# EAGLE design bh (EAGLE 9.6.1)
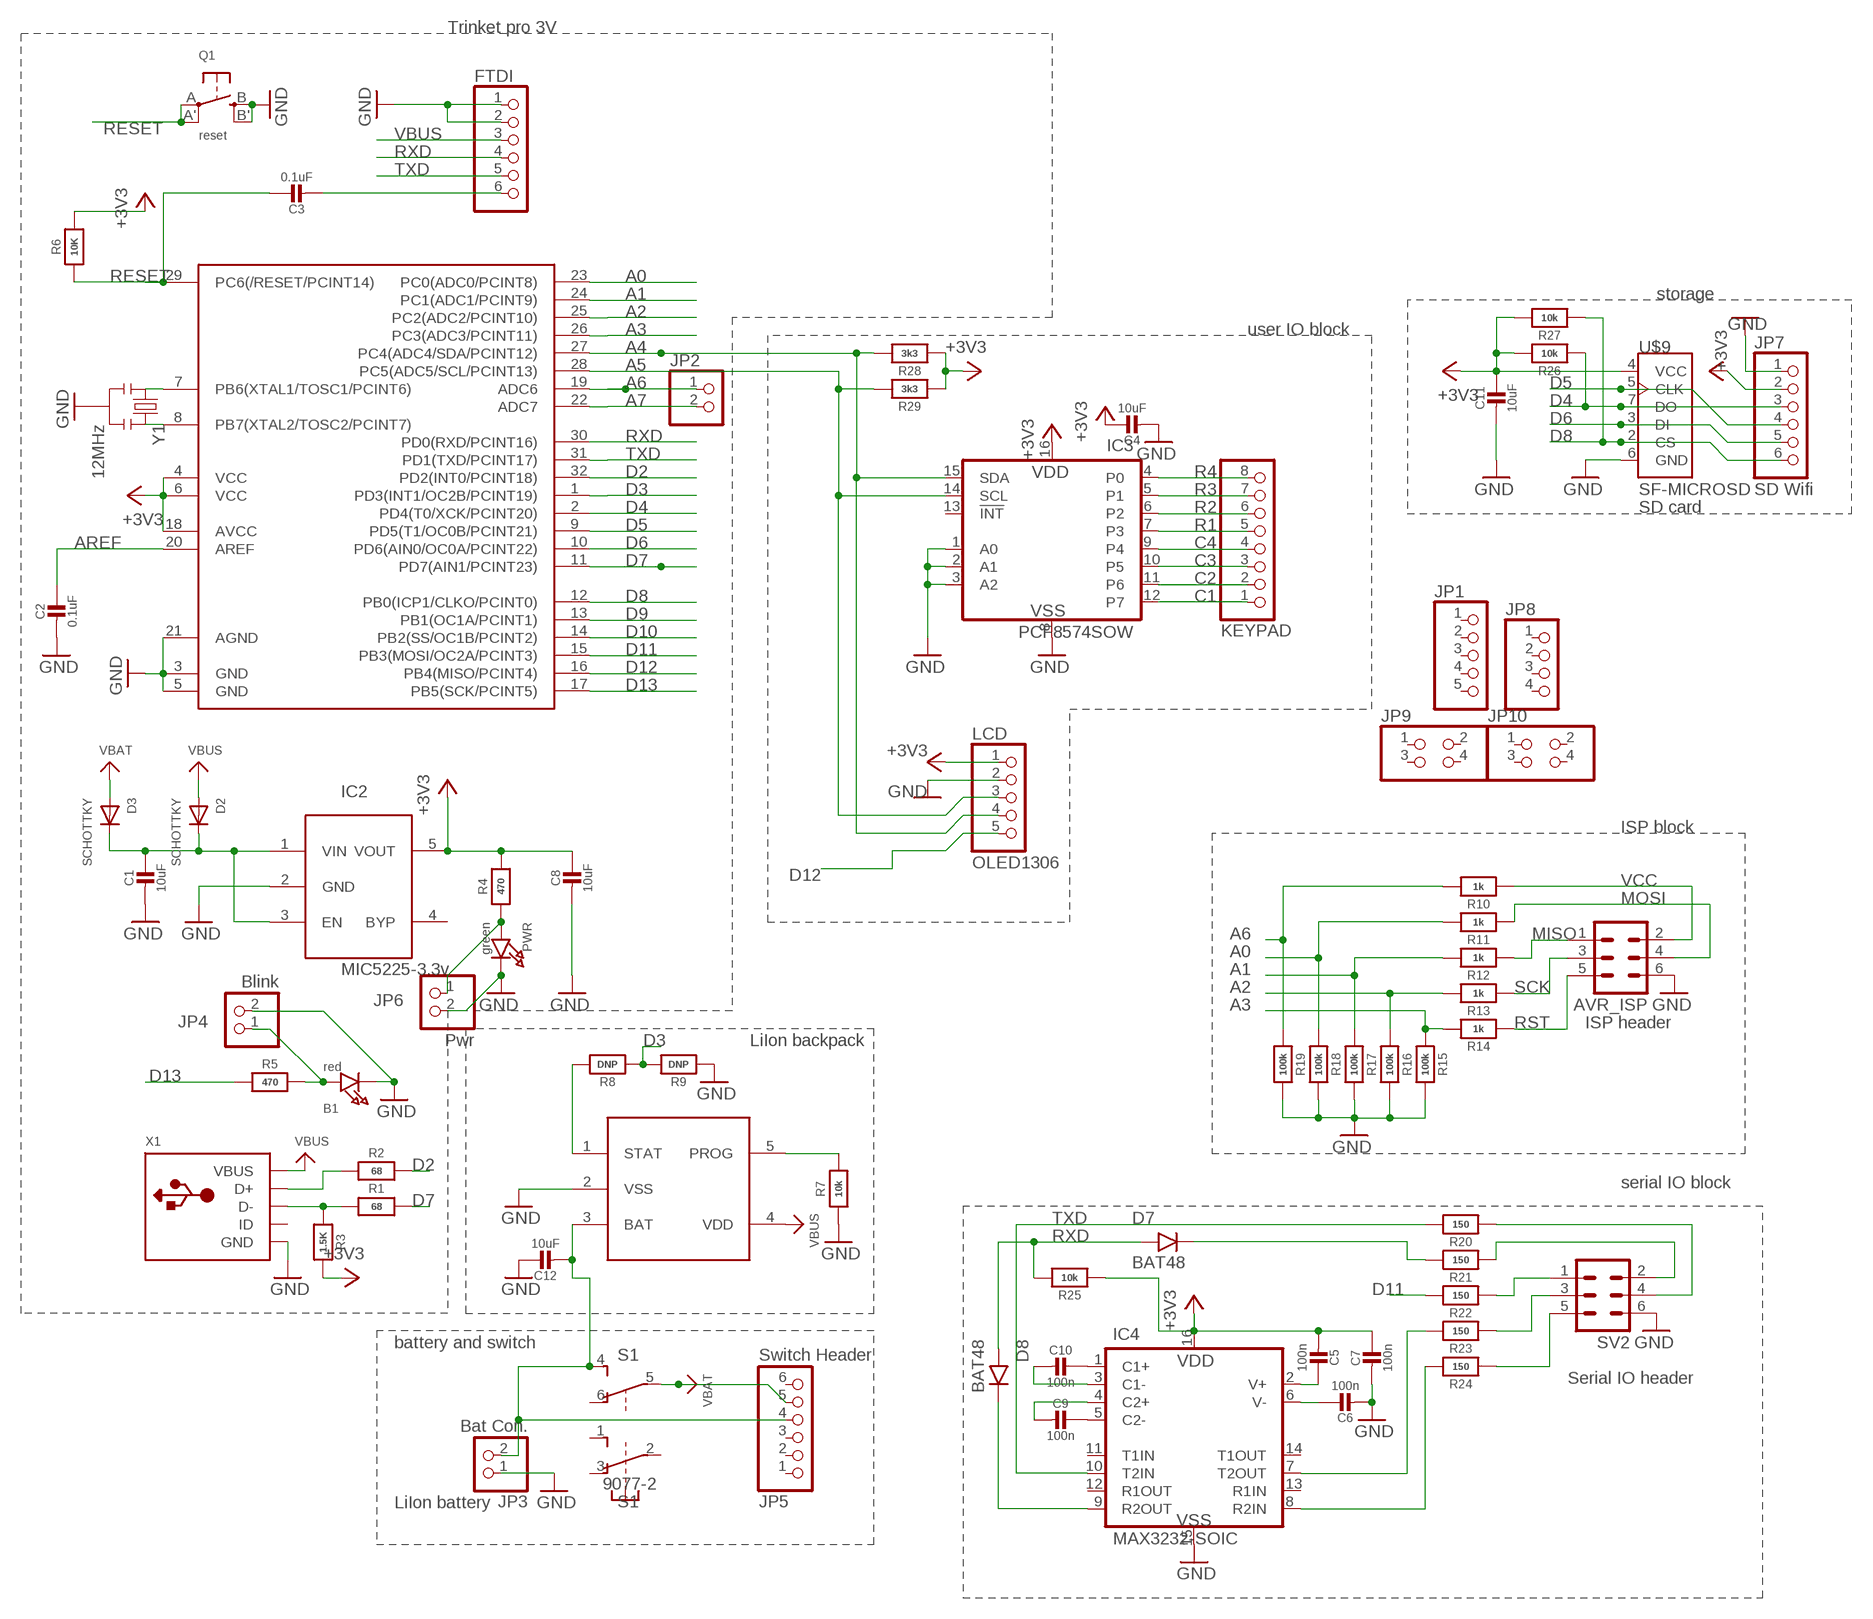
[diagram p0: schematic, sheet 1]

## Parts
AVR_ISP  ML6  [ML6]
B1  red  LED0805_NOOUTLINE  [CHIPLED_0805_NOOUTLINE]
C1  10uF  CAP_CERAMIC0805-NOOUTLINE  [0805-NO]
C2  0.1uF  CAP_CERAMIC_0805MP  [_0805MP]
C3  0.1uF  CAP_CERAMIC0805-NOOUTLINE  [0805-NO]
C4  10uF  CAP_CERAMIC0805-NOOUTLINE  [0805-NO]
C5  100n  CAP_CERAMIC0805-NOOUTLINE  [0805-NO]
C6  100n  CAP_CERAMIC0805-NOOUTLINE  [0805-NO]
C7  100n  CAP_CERAMIC0805-NOOUTLINE  [0805-NO]
C8  10uF  CAP_CERAMIC0805-NOOUTLINE  [0805-NO]
C9  100n  CAP_CERAMIC0805-NOOUTLINE  [0805-NO]
C10  100n  CAP_CERAMIC0805-NOOUTLINE  [0805-NO]
C11  10uF  CAP_CERAMIC0805-NOOUTLINE  [0805-NO]
C12  10uF  CAP_CERAMIC0805-NOOUTLINE  [0805-NO]
D2  SCHOTTKY  ADAFRUIT_DIODE_SOD-123FL  [ADAFRUIT_SOD-123FL]
D3  SCHOTTKY  ADAFRUIT_DIODE_SOD-123FL  [ADAFRUIT_SOD-123FL]
D7  BAT48  1N4148SOD  [SOD-80]
D8  BAT48  1N4148SOD  [SOD-80]
FTDI  ADAFRUIT_PINHD-1X6CB  [ADAFRUIT_1X06-CLEANBIG]
IC2  MIC5225-3.3v  LP298XS  [SOT23-5L]
IC3  PCF8574SOW  [SO-16DW]
IC4  MAX3232-SOIC  [SO-16]
IC5  MEGA328P  MEGA48/88/168-AU  [TQFP32-08]
JP1  PINHD-1X5  [1X05]
JP2  HEADER-1X2ROUND  [1X02_ROUND]
JP3  Bat Con.  PINHD-1X02_2.54-90°  [1X02/90]
JP4  Blink  PINHD-1X2  [1X02]
JP5  Switch Header  PINHD-1X6  [1X06]
JP6  Pwr  PINHD-1X2  [1X02]
JP7  SD Wifi  PINHD-1X6  [1X06]
JP8  PINHD-1X4  [1X04]
JP9  PINHD-2X2  [2X02]
JP10  PINHD-2X2  [2X02]
KEYPAD  PINHD-1X8  [1X08]
LCD  OLED1306  PINHD-1X5  [1X05]
PWR  green  LED0805_NOOUTLINE  [CHIPLED_0805_NOOUTLINE]
Q1  reset  SWITCH_TACT_SMT4.6X2.8  [BTN_KMR2_4.6X2.8]
R1  68  RESISTOR_0603_NOOUT  [0603-NO]
R2  68  RESISTOR_0603_NOOUT  [0603-NO]
R3  1.5K  RESISTOR_0603_NOOUT  [0603-NO]
R4  470  RESISTOR_0603_NOOUT  [0603-NO]
R5  470  RESISTOR_0603_NOOUT  [0603-NO]
R6  10K  RESISTOR0805_NOOUTLINE  [0805-NO]
R7  10k  RESISTOR_0805  [_0805]
R8  DNP  RESISTOR_0805  [_0805]
R9  DNP  RESISTOR_0805  [_0805]
R10  1k  RESISTOR_0805  [_0805]
R11  1k  RESISTOR_0805  [_0805]
R12  1k  RESISTOR_0805  [_0805]
R13  1k  RESISTOR_0805  [_0805]
R14  1k  RESISTOR_0805  [_0805]
R15  100k  RESISTOR_0805  [_0805]
R16  100k  RESISTOR_0805  [_0805]
R17  100k  RESISTOR_0805  [_0805]
R18  100k  RESISTOR_0805  [_0805]
R19  100k  RESISTOR_0805  [_0805]
R20  150  RESISTOR_0805  [_0805]
R21  150  RESISTOR_0805  [_0805]
R22  150  RESISTOR_0805  [_0805]
R23  150  RESISTOR_0805  [_0805]
R24  150  RESISTOR_0805  [_0805]
R25  10k  RESISTOR_0805  [_0805]
R26  10k  RESISTOR_0805  [_0805]
R27  10k  RESISTOR_0805  [_0805]
R28  3k3  RESISTOR_0805  [_0805]
R29  3k3  RESISTOR_0805  [_0805]
S1  9077-2  [9077-2]
SV2  ML6  [ML6]
U$6  MCP73831  [SOT23-5]
U$9  SF-MICROSD  [MICROSD]
X1  MICROBUILDER_USBMICRO_20329  [MICROBUILDER_4UCONN_20329]
Y1  12MHz  RESONATORSMD  [RESONATOR-SMD]

## Nets
+3V3: C4.1 C5.2 C7.1 C8.1 C11.1 IC2.5(VOUT) IC3.16(VDD) IC4.16(VDD) IC5.4(VCC) IC5.6(VCC) IC5.18(AVCC) JP7.2 LCD.1 R3.2 R4.2 R6.2 R25.2 R26.1 R27.1 R28.2 R29.2 U$9.4(VCC)
A0: IC5.23(PC0(ADC0/PCINT8)) R11.1 R18.2
A1: IC5.24(PC1(ADC1/PCINT9)) R12.1 R17.2
A2: IC5.25(PC2(ADC2/PCINT10)) R13.1 R16.2
A3: IC5.26(PC3(ADC3/PCINT11)) R14.1 R15.2
A4: IC3.15(SDA) IC5.27(PC4(ADC4/SDA/PCINT12)) LCD.4 R28.1
A5: IC3.14(SCL) IC5.28(PC5(ADC5/SCL/PCINT13)) LCD.3 R29.1
A6: IC5.19(ADC6) JP2.1 R10.1 R19.2
A7: IC5.22(ADC7) JP2.2
AREF: C2.1 IC5.20(AREF)
C1: IC3.12(P7) KEYPAD.1
C2: IC3.11(P6) KEYPAD.2
C3: IC3.10(P5) KEYPAD.3
C4: IC3.9(P4) KEYPAD.4
D2: IC5.32(PD2(INT0/PCINT18)) R2.2
D3: IC5.1(PD3(INT1/OC2B/PCINT19)) R8.2 R9.1
D4: IC5.2(PD4(T0/XCK/PCINT20)) JP7.3 R26.2 U$9.7(DO)
D5: IC5.9(PD5(T1/OC0B/PCINT21)) JP7.4 U$9.5(CLK)
D6: IC5.10(PD6(AIN0/OC0A/PCINT22)) JP7.5 U$9.3(DI)
D7: IC5.11(PD7(AIN1/PCINT23)) R1.2
D8: IC5.12(PB0(ICP1/CLKO/PCINT0)) JP7.6 R27.2 U$9.2(CS)
D9: IC5.13(PB1(OC1A/PCINT1))
D10: IC5.14(PB2(SS/OC1B/PCINT2))
D11: IC5.15(PB3(MOSI/OC2A/PCINT3)) R22.1
D12: IC5.16(PB4(MISO/PCINT4)) LCD.5
D13: IC5.17(PB5(SCK/PCINT5)) R5.2
D+: R2.1 X1.D+
D-: R1.1 R3.1 X1.D-
DTR/RTS: C3.2 FTDI.6
GND: AVR_ISP.6 B1.C C1.2 C2.2 C4.2 C6.2 C7.2 C8.2 C11.2 C12.1 FTDI.1 FTDI.2 IC2.2(GND) IC3.1(A0) IC3.2(A1) IC3.3(A2) IC3.8(VSS) IC4.15(VSS) IC5.3(GND) IC5.5(GND) IC5.21(AGND) JP3.1 JP4.2 JP6.2 JP7.1 LCD.2 PWR.C Q1.B'(S1) Q1.B(S) R7.2 R9.2 R15.1 R16.1 R17.1 R18.1 R19.1 SV2.6 U$6.2(VSS) U$9.6(GND) X1.BASE@1(GND) X1.BASE@2(GND) X1.GND X1.SPRT@1(GND) X1.SPRT@2(GND) X1.SPRT@3(GND) X1.SPRT@4(GND) Y1.2
MISO: AVR_ISP.1 R12.2
MOSI: AVR_ISP.4 R11.2
N$2: IC5.7(PB6(XTAL1/TOSC1/PCINT6)) Y1.1
N$3: IC5.8(PB7(XTAL2/TOSC2/PCINT7)) Y1.3
N$6: JP6.1 PWR.A R4.1
N$7: C1.1 D2.C D3.C IC2.1(VIN) IC2.3(EN)
N$14: B1.A JP4.1 R5.1
N$20: C12.2 JP3.2 JP5.4 S1.4(2:S) U$6.3(BAT)
N$26: R7.1 U$6.5(PROG)
N$28: R8.1 U$6.1(STAT)
N$37: R20.2 SV2.4
N$38: R21.2 SV2.2
N$39: R22.2 SV2.1
N$40: R23.2 SV2.3
N$41: R24.2 SV2.5
N$43: IC4.7(T2OUT) R23.1
N$44: D7.K R21.1
N$45: D8.K IC4.9(R2OUT)
N$47: C6.1 IC4.6(V-)
N$48: C5.1 IC4.2(V+)
N$50: C9.1 IC4.5(C2-)
N$51: C10.1 IC4.1(C1+)
N$52: C10.2 IC4.3(C1-)
N$53: C9.2 IC4.4(C2+)
N$54: IC4.8(R2IN) R24.1
R1: IC3.7(P3) KEYPAD.5
R2: IC3.6(P2) KEYPAD.6
R3: IC3.5(P1) KEYPAD.7
R4: IC3.4(P0) KEYPAD.8
RESET: C3.1 IC5.29(PC6(/RESET/PCINT14)) Q1.A'(P1) Q1.A(P) R6.1
RST: AVR_ISP.5 R14.2
RXD: D7.A D8.A FTDI.4 IC5.30(PD0(RXD/PCINT16)) R25.1
SCK: AVR_ISP.3 R13.2
TXD: FTDI.5 IC4.10(T2IN) IC5.31(PD1(TXD/PCINT17)) R20.1
VBAT [power]: D3.A JP5.5 S1.5(2:P)
VBUS: D2.A FTDI.3 U$6.4(VDD) X1.VBUS
VCC: AVR_ISP.2 R10.2
Unconnected: IC2.4(BYP) IC3.13(!INT) IC4.11(T1IN) IC4.12(R1OUT) IC4.13(R1IN) IC4.14(T1OUT) JP1.1 JP1.2 JP1.3 JP1.4 JP1.5 JP5.1 JP5.2 JP5.3 JP5.6 JP8.1 JP8.2 JP8.3 JP8.4 JP9.1 JP9.2 JP9.3 JP9.4 JP10.1 JP10.2 JP10.3 JP10.4 S1.1(1:S) S1.2(1:P) S1.3(1:O) S1.6(2:O) X1.ID

## Notes on the sheet
- Trinket pro 3V
- storage
- user IO block
- SD card
- ISP block
- ISP header
- LiIon backpack
- serial IO block
- battery and switch
- Serial IO header
- LiIon battery

## Library data of the parts
AVR_ISP SV2 = con-harting-ml:ML6: HARTING
B1 PWR = microbuilder:LED: LED 0603 - 0603 Surface Mount Package 2mA: Green LED - Low Power (3.9mcd, 2ma, 1.7Vf) - Digikey: 475-2709-2-ND Orange LED - Low Power (9.8mcd, 2ma, 1.8Vf) - Digikey: 475-1194-2-ND Red LED - Low Power (5mcd, 2ma, 1.8Vf) - Digikey: 475-1195-2-ND Yellow LED - Low Power (7mcd, 2ma, 1.8Vf) - Digikey: 475-1196-2-ND 5mA: Blue LED - Low Power (17mcd, 5ma, 2.9Vf) - Digikey: LNJ937W8CRACT-ND 0805 - 0805 Surface Mount Package 2mA: Red LED (8.8mcd, 2mA, 1.8Vf, Clear) - Low Power [Digikey: 475-2510-1-ND] Green LED (5mcd, 2mA, 1.8Vf, Clear) - Low Power [Digikey: 475-2730-1-ND] Yellow LED (11.3mcd, 2mA, 1.8Vf, Clear) - Low Power [Digikey: 475-2555-1-ND] 20mA: Red LED (104mcd, 20mA, Diffused) - LS R976 [Digikey: 475-1278-6-ND] Red LED (12mcd, 20mA, 2.0Vf, Clear) - APT2012EC [Digikey: 754-1128-1-ND] Green LED (15mcd, 20mA, 2.2Vf, Clear) - APT2012GC [Digikey: 754-1131-1-ND] Orange LED (160mcd, 20mA, 2.1Vf, Clear) - APT2012SECK [Digikey: 754-1130-1-ND] 1206 - 1206 Surface Mount Package Green LED (26mcd, 20mA, Diffused) - LG N971 [Digikey: 475-1407-6-ND] Red LED (15mcd, 20mA, Diffused) - LH N974 [Digikey: 475-1416-6-ND] Cree - Cree High-Power Surface Mount LEDs XPEBWT-L1-0000-00D50 - White 111lm 350mA 2.9Vf 6200K 110° XTEAWT-00-0000-00000LEE3 - White 114lm 350mA 2.85Vf 5000K 115° Everlight - Everlight 45-21 Series Surface Mount LEDs 45-21/QK2C-B2832AC2CB2/2T - Warm White 2000mcd 20mA 3.25Vf 3050K 120° 45-21/LK2C-B38452C4CB2/2T - Nuetral White 2000mcd 20mA 3.25Vf 4150K 120° 45-21/LK2C-B50634C6CB2/2T - Cold White 2200mcd 20mA 3.25Vf 5650K 120° PLCC2 Reverse Mount LS T77K-J1L2-1-0-2-R18-Z - Red 11.25mcd 2mA 1.8Vf 630nm 120° LO T77K-L1M2-24-Z - Orange 19.6mcd 2mA 1.8Vf 606nm 120° LY T77K-K2M1-26-Z - Yellow 15.7mcd 2mA 1.8Vf 587nm 120°
C1-C12 = microbuilder:CAP_CERAMIC: Ceramic Capacitors For new designs, use the packages preceded by an '_' character since they are more reliable: The following footprints should be used on most boards: _0402 - Standard footprint for regular board layouts _0603 - Standard footprint for regular board layouts _0805 - Standard footprint for regular board layouts _1206 - Standard footprint for regular board layouts For extremely tight-pitch boards where space is at a premium, the following 'micro-pitch' footprints can be used (smaller pads, no silkscreen outline, etc.): _0402MP - Micro-pitch footprint for very dense/compact boards _0603MP - Micro-pitch footprint for very dense/compact boards _0805MP - Micro-pitch footprint for very dense/compact boards _1206MP - Micro-pitch footprint for very dense/compact boards
D2 D3 = Adafruit Pro Trinket 3v3:ADAFRUIT_DIODE: Diode SMADIODE - SMA Surface Mount Package 20V 1A Schottky Diode Digikey: 641-1014-6-ND DO-1N4148 - Through Hole Small Current Diode SOD-123 20V 1 A (.5mV Vf) Schottky Diode - Digikey: MBRX120TPMSCT-ND SOD-323 10V 570mA (.38mV Vf, 3ns) Schottky Diode - Digikey: ZLLS410CT-ND SOD-523 30V 30mA Schottky Diode (RB751S-40TE61) - Digikey: RB751S-40TE61CT-ND SOT23-R/W - SOT23 Package (R = Solder Paste/Reflow Ovens, W = Hand-Soldering) BAT54Film 40V 300mA - Digikey: 497-7162-1-ND
D7 D8 = _mcom5:1N4148
FTDI = Adafruit Pro Trinket 3v3:ADAFRUIT_PINHD-1X6: PIN HEADER
IC2 = adafruit:LP298X
IC3 = _mcom5:PCF8574
IC4 = _mcom5:MAX3232
IC5 = avr-6:MEGA48/88/168
JP1 LCD = pinhead:PINHD-1X5: PIN HEADER
JP2 = microbuilder:HEADER-1X2: PIN HEADER
JP3 = pinhead-2:PINHD-1X02: PIN HEADER
JP4 JP6 = pinhead:PINHD-1X2: PIN HEADER
JP5 JP7 = pinhead:PINHD-1X6: PIN HEADER
JP8 = pinhead:PINHD-1X4: PIN HEADER
JP9 JP10 = pinhead:PINHD-2X2: PIN HEADER
KEYPAD = pinhead:PINHD-1X8: PIN HEADER
Q1 = microbuilder:SWITCH_TACT_SMT: SMT Tact Switches 6x6mm - Digikey: P12940SCT-ND KMR2 (4.6x2.8mm) - Digikey: 401-1426-1-ND EVQ-PQHB55 - Light Touch, 160GF (4.5x4.5mm) - Digikey: P8090SCT-ND KMT0 - KMT021 NGJ LHS (etc.) IP68/Waterproof - Digikey: CKN10289CT-ND
R1-R29 = microbuilder:RESISTOR: Resistors For new designs, use the packages preceded by an '_' character since they are more reliable: The following footprints should be used on most boards: _0402 - Standard footprint for regular board layouts _0603 - Standard footprint for regular board layouts _0805 - Standard footprint for regular board layouts _1206 - Standard footprint for regular board layouts For extremely tight-pitch boards where space is at a premium, the following 'micro-pitch' footprints can be used (smaller pads, no silkscreen outline, etc.): _0402MP - Micro-pitch footprint for very dense/compact boards _0603MP - Micro-pitch footprint for very dense/compact boards _0805MP - Micro-pitch footprint for very dense/compact boards _1206MP - Micro-pitch footprint for very dense/compact boards
S1 = switch-misc:9077-2: MARQUARDT SWITCH
U$6 = _moja:MCP73831
U$9 = microsd:SF-MICROSD
X1 = Adafruit Pro Trinket 3v3:MICROBUILDER_USB: USB Connectors USBMINIB - Surface Mount Female Mini-B USB Connector 4UConnector: 06564
Y1 = SparkFun:RESONATOR: Resonator Small SMD resonator. This is the itty bitty 10/20MHz resonators with built in caps. CSTCE10M0G55 and CSTCE20M0V53. Footprint has been reviewed closely but hasn't been tested yet.

## Net classes
0 default: width 0.254 mm, clearance 0.305 mm
1 power: width 0.254 mm, clearance 0.305 mm

## Board
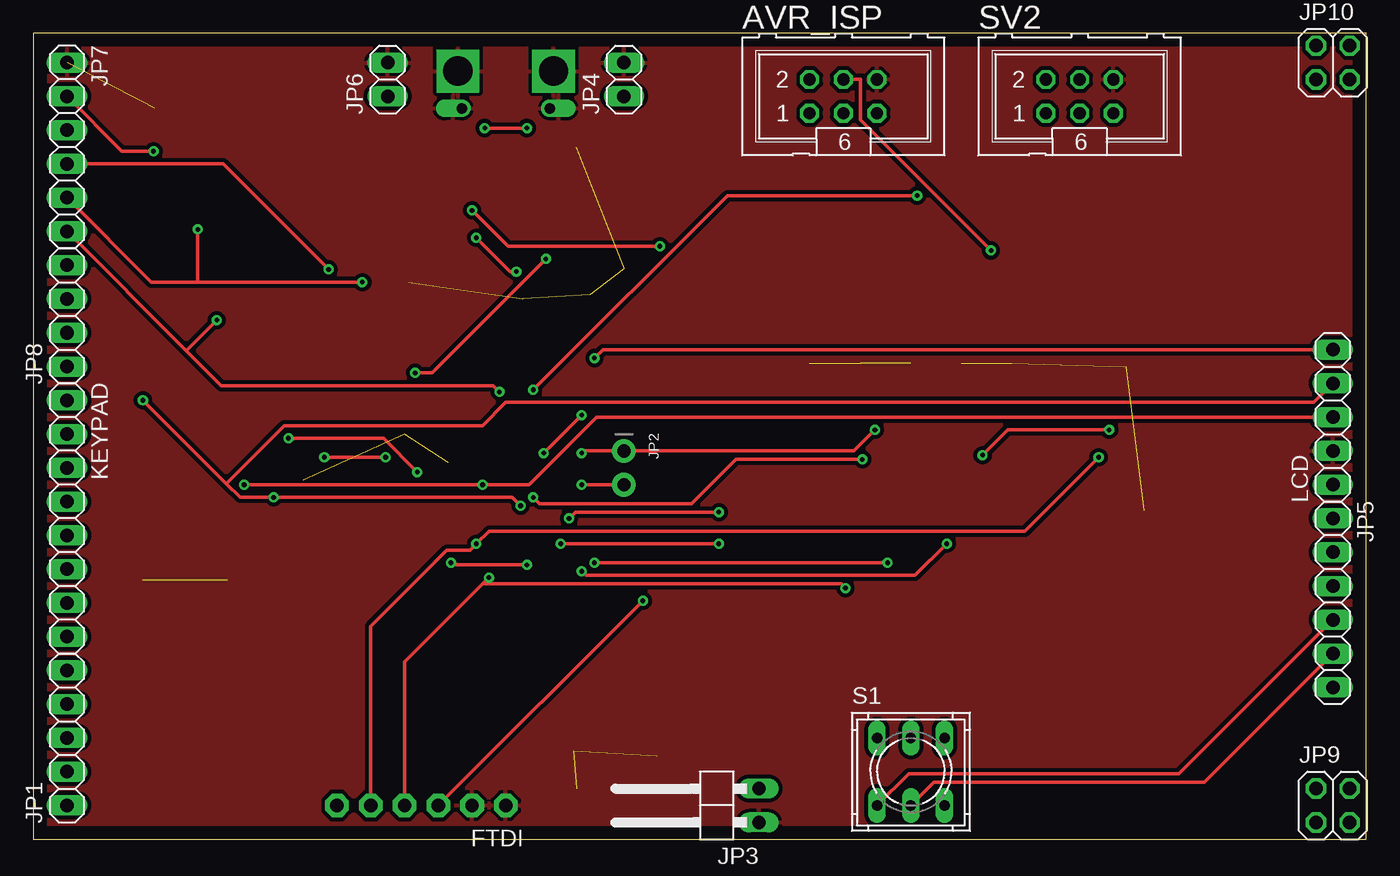
[diagram p1: board, top side]
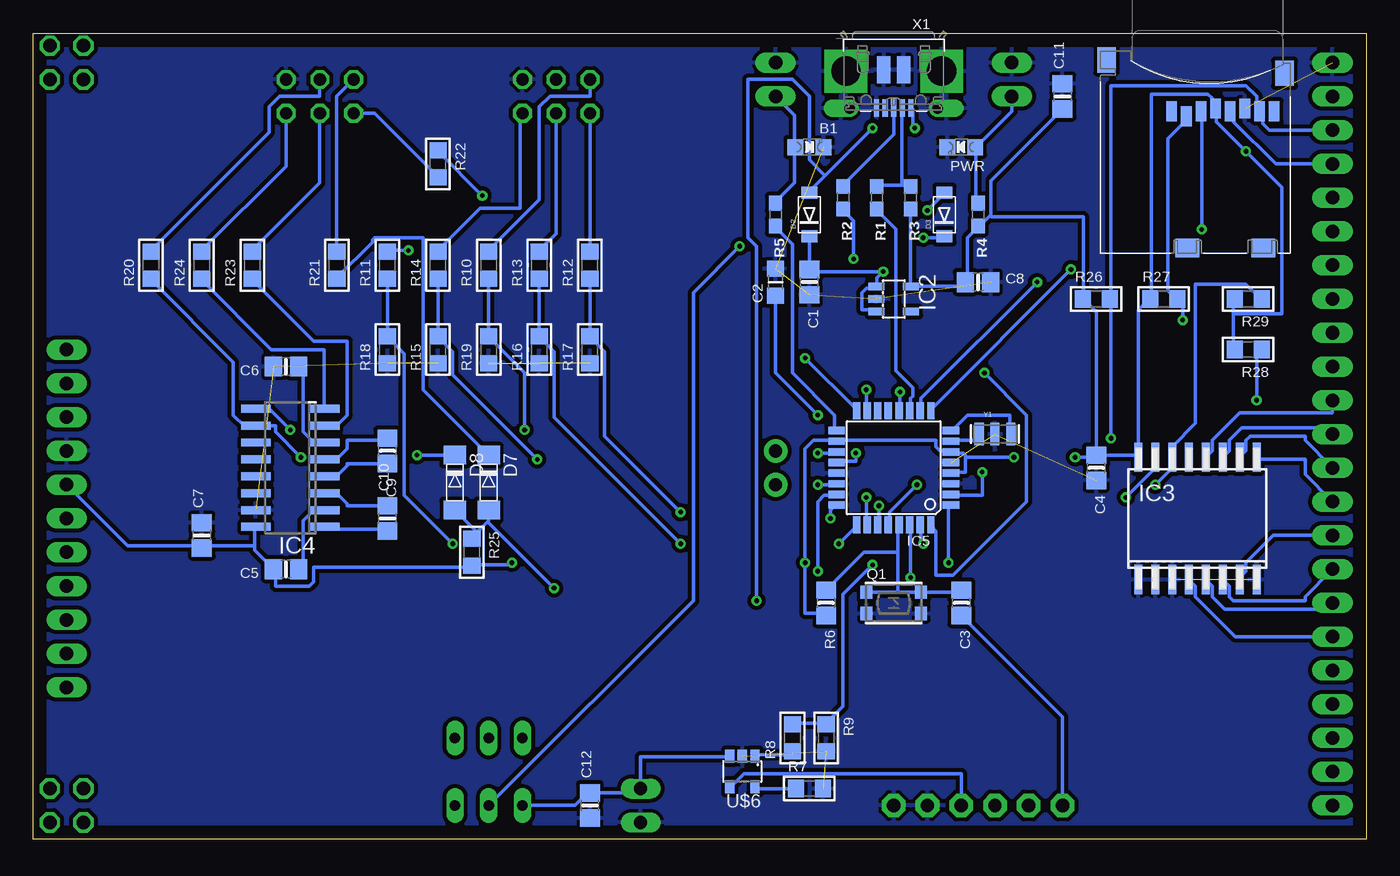
[diagram p2: board, bottom side, seen from below]

Size 100.31 x 60.63 mm. Coordinates in mm from the lower left corner, seen from the top.
Outline: 0,0 100.31,0 100.31,60.63 0,60.63 0,0
Copper layers (1*16): Top 0.035mm / dielectric 1.5mm / Bottom 0.035mm
Design rules "default": minimum track width 6mil, minimum drill 0.35mm, track to track 6mil, track to pad 6mil, pad to pad 6mil, via to via 6mil, smd to smd 6mil, copper to edge 40mil, drill to drill 6mil, minimum pad ring 10mil, minimum via ring 8mil, stop-mask expansion 4mil, vias tented up to drill 0mil, thermal gap 10mil

### Footprints (pad centres in the part's own frame; a part is rotated, then mirrored left to right if it is on the bottom)
ML6 = drill 0.914 octagon: 1 -2.54,-1.27; 2 -2.54,1.27; 3 0,-1.27; 4 0,1.27; 5 2.54,-1.27; 6 2.54,1.27
CHIPLED_0805_NOOUTLINE = smd 1.2 x 1.2: A 0,-1.05; C 0,1.05
0805-NO = smd 1.3 x 1.5: 1 -0.95,0; 2 0.95,0
_0805MP = smd 1.2 x 1.3: 1 -1.016,0; 2 1.016,0
ADAFRUIT_SOD-123FL = smd 0.91 x 1.22: A 1.637,0; C -1.637,0
SOD-80 = smd 1.397 x 1.702: A 1.905,0; K -2.223,0
ADAFRUIT_1X06-CLEANBIG = drill 1 pad 1.778 octagon: 1 -6.35,0; 2 -3.81,0; 3 -1.27,0; 4 1.27,0; 5 3.81,0; 6 6.35,0
SOT23-5L = smd 0.55 x 1.2: 1 -0.95,-1.3; 2 0,-1.3; 3 0.95,-1.3; 4 0.95,1.3; 5 -0.95,1.3
SO-16DW = smd 0.6 x 2.2: 1 -4.445,-4.6; 2 -3.175,-4.6; 3 -1.905,-4.6; 4 -0.635,-4.6; 5 0.635,-4.6; 6 1.905,-4.6; 7 3.175,-4.6; 8 4.445,-4.6; 9 4.445,4.6; 10 3.175,4.6; 11 1.905,4.6; 12 0.635,4.6; 13 -0.635,4.6; 14 -1.905,4.6; 15 -3.175,4.6; 16 -4.445,4.6
SO-16 = smd 0.6 x 2.2: 1 -4.445,-2.917; 2 -3.175,-2.917; 3 -1.905,-2.917; 4 -0.635,-2.917; 5 0.635,-2.917; 6 1.905,-2.917; 7 3.175,-2.917; 8 4.445,-2.917; 9 4.445,2.283; 10 3.175,2.283; 11 1.905,2.283; 12 0.635,2.283; 13 -0.635,2.283; 14 -1.905,2.283; 15 -3.175,2.283; 16 -4.445,2.283
TQFP32-08 = smd 1.27 x 0.559: 1 -4.293,2.8; 2 -4.293,2; 3 -4.293,1.2; 4 -4.293,0.4; 5 -4.293,-0.4; 6 -4.293,-1.2; 7 -4.293,-2; 8 -4.293,-2.8; 17 4.293,-2.8; 18 4.293,-2; 19 4.293,-1.2; 20 4.293,-0.4; 21 4.293,0.4; 22 4.293,1.2; 23 4.293,2; 24 4.293,2.8 | smd 0.559 x 1.27: 9 -2.8,-4.293; 10 -2,-4.293; 11 -1.2,-4.293; 12 -0.4,-4.293; 13 0.4,-4.293; 14 1.2,-4.293; 15 2,-4.293; 16 2.8,-4.293; 25 2.8,4.293; 26 2,4.293; 27 1.2,4.293; 28 0.4,4.293; 29 -0.4,4.293; 30 -1.2,4.293; 31 -2,4.293; 32 -2.8,4.293
1X05 = drill 1.016 long: 1 -5.08,0; 2 -2.54,0; 3 0,0; 4 2.54,0; 5 5.08,0
1X02_ROUND = drill 1 pad 1.778: 1 -1.27,0; 2 1.27,0
1X02/90 = drill 1 long: 1 -2.54,-3.81; 2 0,-3.81
1X02 = drill 1.016 long: 1 -1.27,0; 2 1.27,0
1X06 = drill 1.016 long: 1 -6.35,0; 2 -3.81,0; 3 -1.27,0; 4 1.27,0; 5 3.81,0; 6 6.35,0
1X04 = drill 1.016 long: 1 -3.81,0; 2 -1.27,0; 3 1.27,0; 4 3.81,0
2X02 = drill 1.016 octagon: 1 -1.27,-1.27; 2 -1.27,1.27; 3 1.27,-1.27; 4 1.27,1.27
1X08 = drill 1.016 long: 1 -8.89,0; 2 -6.35,0; 3 -3.81,0; 4 -1.27,0; 5 1.27,0; 6 3.81,0; 7 6.35,0; 8 8.89,0
BTN_KMR2_4.6X2.8 = smd 0.9 x 1: A 2.05,0.8; A' -2.05,0.8; B 2.05,-0.8; B' -2.05,-0.8
0603-NO = smd 1.1 x 1: 1 -0.85,0; 2 0.85,0
_0805 = smd 1.2 x 1.3: 1 -1.016,0; 2 1.016,0
9077-2 = drill 0.8 long: 1 -2.54,2.54; 2 0,2.54; 3 2.54,2.54; 4 -2.54,-2.54; 5 0,-2.54; 6 2.54,-2.54
SOT23-5 = smd 0.7 x 1: 1 -0.99,-1.17; 2 -0.04,-1.17; 3 0.91,-1.17; 4 0.91,1.13; 5 -0.99,1.13
MICROSD = smd 0.8 x 1.5: 1 -1.94,2.7; 2 -0.84,2.3; 3 0.26,2.7; 4 1.36,2.9; 5 2.46,2.7; 6 3.56,2.9; 7 4.66,2.7; 8 5.76,2.7 | smd 1.4 x 1.9: NC -6.85,6.55; NC3 6.55,5.55 | smd 1.8 x 1.4: NC1 -0.75,-7.6; NC2 4.95,-7.6
MICROBUILDER_4UCONN_20329 = smd 1 x 2: BASE@1 -0.75,-2; BASE@2 0.75,-2 | smd 0.4 x 1.35: D+ 0,0.875; D- -0.65,0.875; GND 1.3,0.875; ID 0.65,0.875; VBUS -1.3,0.875 | drill 0.8 offset: SPRT@1 -3.3,0.9; SPRT@2 3.3,0.9 | drill 2.2 pad 2.7 square: SPRT@3 -3.6,-1.9; SPRT@4 3.6,-1.9
RESONATOR-SMD = smd 0.7 x 1.7: 1 -1.2,0; 2 0,0; 3 1.2,0

### Placement (x,y rotation side)
AVR_ISP  60.96,55.88 0 top
B1  41.91,52.07 270 bottom
C1  41.91,41.91 270 bottom
C2  44.45,41.91 90 bottom
C3  30.48,17.78 270 bottom
C4  20.32,27.94 270 bottom
C5  81.28,20.32 180 bottom
C6  81.28,35.56 180 bottom
C7  87.63,22.86 90 bottom
C8  29.21,41.91 0 bottom
C9  73.66,29.21 270 bottom
C10  73.66,24.13 90 bottom
C11  22.86,55.88 90 bottom
C12  58.42,2.54 90 bottom
D2  41.91,46.99 90 bottom
D3  31.75,46.99 90 bottom
D7  66.04,26.67 270 bottom
D8  68.58,26.67 270 bottom
FTDI  29.21,2.54 180 top
IC2  35.56,40.64 270 bottom
IC3  12.7,24.13 0 bottom
IC4  81.28,27.94 90 bottom
IC5  35.56,27.94 180 bottom
JP1  2.54,7.62 90 top
JP2  44.45,27.94 270 top
JP3  50.8,3.81 90 top
JP4  44.45,57.15 90 top
JP5  97.79,17.78 270 top
JP6  26.67,57.15 90 top
JP7  2.54,52.07 270 top
JP8  2.54,39.37 90 top
JP9  97.79,2.54 0 top
JP10  97.79,58.42 0 top
KEYPAD  2.54,24.13 270 top
LCD  97.79,31.75 90 top
PWR  30.48,52.07 90 bottom
Q1  35.56,17.78 0 bottom
R1  36.83,48.26 270 bottom
R2  39.37,48.26 270 bottom
R3  34.29,48.26 270 bottom
R4  29.21,46.99 270 bottom
R5  44.45,46.99 270 bottom
R6  40.64,17.78 270 bottom
R7  41.91,3.81 0 bottom
R8  43.18,7.62 90 bottom
R9  40.64,7.62 270 bottom
R10  66.04,43.18 90 bottom
R11  73.66,43.18 90 bottom
R12  58.42,43.18 90 bottom
R13  62.23,43.18 90 bottom
R14  69.85,43.18 90 bottom
R15  69.85,36.83 90 bottom
R16  62.23,36.83 90 bottom
R17  58.42,36.83 90 bottom
R18  73.66,36.83 90 bottom
R19  66.04,36.83 90 bottom
R20  91.44,43.18 90 bottom
R21  77.47,43.18 90 bottom
R22  69.85,50.8 270 bottom
R23  83.82,43.18 90 bottom
R24  87.63,43.18 90 bottom
R25  67.31,21.59 270 bottom
R26  20.32,40.64 0 bottom
R27  15.24,40.64 0 bottom
R28  8.89,36.83 180 bottom
R29  8.89,40.64 180 bottom
S1  66.04,5.08 0 top
SV2  78.74,55.88 0 top
U$6  46.99,5.08 180 bottom
U$9  12.7,52.07 0 bottom
X1  35.56,55.88 180 bottom
Y1  27.94,30.48 0 bottom

### Tracks (layer width: path | path; a pad name or v marks a point on that pad's centre or on a via)
+3V3  (via drill 0.35)
  Top 0.254: JP7.2 6.67,51.75 v9.05,51.75 | v21.91,28.73 v26.51,28.73 | v42.23,20.8 v64.29,20.8
  Bottom 0.254: 83.66,22.07 87.63,22.07 | 83.66,22.07 83.66,23.5 IC4.16 | LCD.1 93.19,22.07 87.63,22.07 | 87.63,22.07 C7.1 | 83.66,22.07 83.66,21.75 C5.2 82.07,20.32 82.07,19.05 79.53,19.05 79.22,19.37 79.22,20.48 67.31,20.48 R25.2 67.31,20.64 64.29,20.64 v64.29,20.8 | R3.2 34.29,41.59 IC2.5 34.13,41.59 30.16,41.59 C8.1 30,41.91 30,45.24 29.21,46.04 | 29.21,46.04 28.34,46.91 | 28.34,46.91 28.26,46.99 28.26,49.53 C11.1 | 29.21,46.04 R4.2 | 30.16,28.73 30.16,28.89 30.32,29.05 31.11,29.05 IC5.6 31.27,29.21 32.07,29.21 32.38,29.53 32.38,30 39.85,30 IC5.18 40.01,30 41.59,30 42.23,29.37 v42.23,20.8 42.23,16.99 40.64,16.99 R6.2 | 30.16,28.73 30.16,27.62 31.11,27.62 IC5.4 | 21.27,40.64 20.32,39.69 C4.1 | 10,39.53 10,40.64 R29.2 | 10,39.53 10,36.83 R28.2 | 17.14,28.89 IC3.16 | 17.14,28.89 17.14,39.85 16.35,40.64 R27.1 16.19,40.64 16.19,56.04 11.91,56.04 11.59,55.72 11.59,55.24 11.43,55.09 U$9.4 11.27,54.93 11.27,53.98 v9.05,51.75 6.35,49.05 6.35,39.53 10,39.53 | 17.14,28.89 C4.1 | C4.1 20.32,28.73 v21.91,28.73 | v26.51,28.73 30.16,28.73 | 21.27,40.64 21.27,46.83 28.26,46.83 28.34,46.91 | 21.27,40.64 R26.1
A0  (via drill 0.35)
  Top 0.254: v41.27,20.16 41.59,19.84 66.36,19.84 v68.74,22.23
  Bottom 0.254: v41.27,20.16 41.27,25.4 40.8,25.88 40.01,25.88 IC5.23 | v68.74,22.23 72.39,25.88 72.39,36.51 73.66,37.78 R18.2 R11.1
A1  (via drill 0.35)
  Top 0.254: v40.32,24.13 40.8,24.61 v51.59,24.61
  Bottom 0.254: v40.32,24.13 40.32,24.77 40.01,25.08 IC5.24 | v51.59,24.61 57.31,30.32 57.31,36.67 58.42,37.78 R17.2 R12.1
A2  (via drill 0.35)
  Top 0.254: v51.59,22.23 v39.69,22.23
  Bottom 0.254: v39.69,22.23 38.42,23.5 IC5.25 | v51.59,22.23 61.12,31.75 61.12,36.67 62.23,37.78 R16.2 R13.1
A3  (via drill 0.35)
  Top 0.254: v37.62,25.72 38.1,25.24 49.53,25.24 52.86,28.57 v62.39,28.57
  Bottom 0.254: v37.62,25.72 37.62,23.65 IC5.26 | v62.39,28.57 68.74,34.92 68.74,36.67 69.85,37.78 R15.2 R14.1
A4  (via drill 0.35)
  Top 0.254: v36.67,25.08 36.04,25.72 v18.1,25.72 15.56,25.72 14.53,26.75 | 14.53,26.75 v8.26,33.02 | LCD.4 96.36,32.86 35.56,32.86 33.81,31.11 18.89,31.11 14.53,26.75
  Bottom 0.254: v36.67,25.08 36.67,23.65 IC5.27 | v18.1,25.72 15.88,27.94 IC3.15 | v8.26,33.02 8.26,36.51 7.94,36.83 R28.1
A5  (via drill 0.35)
  Top 0.254: v15.88,26.67 v33.81,26.67 37.31,26.67 42.39,31.75 LCD.3
  Bottom 0.254: v33.81,26.67 35.88,24.61 35.88,23.65 IC5.28 | v15.88,26.67 14.61,27.94 IC3.14 14.61,29.53 12.86,31.27 12.86,41.75 9.05,41.75 7.94,40.64 R29.1
A6  (via drill 0.35)
  Top 0.254: v41.27,29.05 41.43,29.21 JP2.1 61.75,29.21 v63.34,30.8
  Bottom 0.254: R10.1 R19.2 66.04,37.78 63.34,35.08 v63.34,30.8 | v41.27,29.05 40.01,29.05 IC5.19
A7  (via drill 0.35)
  Top 0.254: JP2.2 v41.27,26.67
  Bottom 0.254: v41.27,26.67 40.01,26.67 IC5.22
AREF  (via drill 0.35)
  Top 0.254: v41.27,31.91 v38.42,29.05
  Bottom 0.254: v38.42,29.05 38.42,28.42 39.85,28.42 IC5.20 | v41.27,31.91 44.45,35.08 C2.1
C1
  Bottom 0.254: KEYPAD.1 2.54,32.07 9.53,32.07 11.59,30 11.59,29.21 IC3.12
C2
  Bottom 0.254: KEYPAD.2 2.54,30.96 9.37,30.96 10.32,30 10.32,29.21 IC3.11
C3
  Bottom 0.254: KEYPAD.3 4.6,30 4.6,30.32 8.73,30.32 9.05,30 9.05,29.21 IC3.10
C4
  Bottom 0.254: KEYPAD.4 4.6,27.46 4.6,28.57 8.26,28.57 IC3.9
D2  (via drill 0.35)
  Top 0.254: v38.58,43.66 30,35.08 v28.73,35.08
  Bottom 0.254: v38.58,43.66 38.58,46.51 39.37,47.31 R2.2 | v28.73,35.08 25.56,31.91 25.56,25.4 31.11,19.84 32.38,19.84 32.38,23.18 32.7,23.5 IC5.32
D3  (via drill 0.35)
  Top 0.254: v31.43,20.8 31.59,20.64 v37.15,20.64
  Bottom 0.254: v31.43,20.8 31.43,24.92 31.27,25.08 IC5.1 | v37.15,20.64 39.37,18.41 39.37,10 40.64,8.73 | 40.64,8.73 43.18,8.73 R8.2 | 40.64,8.73 R9.1
D4  (via drill 0.35)
  Top 0.254: v28.89,27.62 26.35,30.16 v19.21,30.16
  Bottom 0.254: JP7.3 7.3,53.34 7.78,53.82 7.78,54.61 7.94,54.77 U$9.7 8.1,54.93 8.26,55.09 8.26,55.88 9.05,56.67 19.21,56.67 19.21,40.64 | v28.89,27.62 28.89,25.88 31.11,25.88 IC5.2 | 19.21,40.64 v19.21,30.16 | 19.21,40.64 R26.2
D5  (via drill 0.35)
  Top 0.254: v22.23,42.86 14.29,50.8 JP7.4
  Bottom 0.254: v22.23,42.86 32.7,32.38 IC5.9 | JP7.4 6.83,50.8 10,53.98 10,54.61 10.16,54.77 U$9.5
D6  (via drill 0.35)
  Top 0.254: 12.38,41.91 8.89,41.91 JP7.5 | 12.38,41.91 v24.77,41.91 | 12.38,41.91 v12.38,45.88
  Bottom 0.254: v24.77,41.91 33.5,33.18 33.5,32.38 IC5.10 | v12.38,45.88 12.38,54.77 U$9.3
D7
  Bottom 0.254: R1.2 36.83,47.31 35.4,45.88 35.4,35.24 34.13,33.97 34.13,33.34 34.29,33.18 34.29,32.38 IC5.11
D8  (via drill 0.35)
  Top 0.254: v35.08,33.66 34.61,34.13 14.13,34.13 11.51,36.75 | JP7.6 11.51,36.75 | 11.51,36.75 v13.81,39.05
  Bottom 0.254: U$9.2 13.65,54.29 13.65,53.98 14.92,52.7 14.92,41.27 14.29,40.64 R27.2 14.13,40.64 13.81,40.32 v13.81,39.05 | v35.08,33.66 35.08,32.38 IC5.12
D11  (via drill 0.35)
  Top 0.254: v37.62,33.81 52.23,48.42 v66.52,48.42
  Bottom 0.254: v37.62,33.81 37.62,32.38 IC5.15 | v66.52,48.42 69.85,51.75 R22.1
D12  (via drill 0.35)
  Top 0.254: v42.23,36.2 42.86,36.83 LCD.5
  Bottom 0.254: v42.23,36.2 38.42,32.38 IC5.16
D13
  Bottom 0.254: R5.2 44.45,46.04 43.18,44.77 43.18,35.08 40.01,31.91 40.01,30.8 IC5.17
D+
  Bottom 0.254: X1.D+ 35.56,53.02 39.37,49.21 R2.1
D-
  Bottom 0.254: 34.92,49.21 36.83,49.21 R1.1 | 34.92,49.21 34.29,49.21 R3.1 | 34.92,49.21 34.92,54.93 X1.D-
DTR/RTS
  Bottom 0.254: FTDI.6 22.86,9.21 C3.2
GND  (15 unrouted)
  pour Bottom: 0,59.69 0,0 -1.27,-1.27 101.6,-1.27 101.6,60.96 100.33,62.23 2.54,62.23
  pour Top: -1.27,63.5 -1.27,-1.27 101.6,-1.27 102.87,0 102.87,60.96 101.6,62.23 100.33,63.5
MISO
  Bottom 0.254: AVR_ISP.1 R12.2
MOSI  (via drill 0.35)
  Top 0.254: v72.07,44.29 62.23,54.13 62.23,57.15 AVR_ISP.4
  Bottom 0.254: v72.07,44.29 73.66,44.29 R11.2
N$2
  Bottom 0.254: IC5.7 31.11,30 29.21,30 29.21,30.48 Y1.1
N$3
  Bottom 0.254: IC5.8 31.11,30.8 30,31.91 26.83,31.91 26.83,30.48 Y1.3
N$6
  Bottom 0.254: 29.37,52.07 29.37,48.1 29.21,47.94 R4.1 | 29.37,52.07 26.67,54.77 JP6.1 | 29.37,52.07 PWR.A
N$7  (via drill 0.35)
  Top 0.254: v33.34,45.24 35.88,42.7 v36.35,42.7
  Bottom 0.254: D2.C C1.1 41.91,42.7 v36.35,42.7 36.83,42.23 36.83,41.59 IC2.1 36.99,41.43 37.62,41.43 37.94,41.12 37.94,39.85 36.99,39.85 IC2.3 | v33.34,45.24 31.75,45.24 D3.C
N$14
  Bottom 0.254: 43.02,52.07 43.02,49.37 44.45,47.94 R5.1 | JP4.1 43.02,54.45 43.02,52.07 | 43.02,52.07 B1.A
N$20
  Top 0.254: JP5.4 86.2,4.92 65.88,4.92 S1.4
  Bottom 0.254: U$6.3 47.94,6.19 54.61,6.19 JP3.2 54.61,3.49 C12.2 58.42,3.33 58.74,3.33 59.53,2.54 S1.4
N$26
  Bottom 0.254: R7.1 45.88,3.81 U$6.5
N$28
  Bottom 0.254: R8.1 43.18,6.35 45.88,6.35 U$6.1
N$37
  Bottom 0.254: SV2.4 78.74,55.88 81.76,55.88 82.55,55.09 82.55,53.18 91.44,44.29 R20.2
N$38
  Bottom 0.254: R21.2 77.47,55.88 SV2.2
N$39
  Bottom 0.254: SV2.1 74.61,54.61 69.85,49.85 R22.2
N$40
  Bottom 0.254: SV2.3 78.74,49.37 83.82,44.29 R23.2
N$41
  Bottom 0.254: SV2.5 81.28,50.64 87.63,44.29 R24.2
N$43
  Bottom 0.254: IC4.7 77.47,31.11 76.68,31.91 76.68,37.47 79.22,37.47 83.82,42.07 R23.1
N$44
  Bottom 0.254: D7.K 70.96,33.81 70.96,45.24 74.61,45.24 74.77,45.09 74.77,44.93 77.47,42.23 R21.1
N$45  (via drill 0.35)
  Top 0.254: v71.44,28.89 73.34,30.8 v80.96,30.8
  Bottom 0.254: v71.44,28.89 D8.K | v80.96,30.8 82.55,32.38 IC4.9
N$47
  Bottom 0.254: IC4.6 79.22,29.84 80.01,30.64 80.01,35.24 C6.1
N$48
  Bottom 0.254: IC4.2 79.22,24.77 80.01,23.97 80.01,20.64 C5.1
N$50
  Bottom 0.254: IC4.5 77.47,28.57 76.68,29.37 76.68,30 73.66,30 C9.1
N$51
  Bottom 0.254: C10.1 73.66,23.34 78.26,23.34 78.26,23.5 IC4.1
N$52
  Bottom 0.254: IC4.3 77.47,26.04 76.68,25.24 76.68,25.08 C10.2
N$53
  Bottom 0.254: IC4.4 77.47,27.3 76.68,28.1 76.68,28.26 C9.2
N$54
  Bottom 0.254: R24.1 87.63,42.07 82.39,36.83 78.42,36.83 78.42,32.38 IC4.8
R1
  Bottom 0.254: KEYPAD.5 6.99,22.86 9.05,20.8 9.05,20.16 9.53,19.68 IC3.7
R2
  Bottom 0.254: KEYPAD.6 4.6,18.26 4.6,17.94 10,17.94 10.32,18.26 10.32,19.05 IC3.6
R3
  Bottom 0.254: KEYPAD.7 2.54,17.3 10.64,17.3 11.59,18.26 11.59,19.05 IC3.5
R4
  Bottom 0.254: KEYPAD.8 9.84,15.24 12.86,18.26 12.86,19.05 IC3.4
RESET
  Bottom 0.254: C3.1 30.48,18.57 33.5,18.57 Q1.A 33.66,18.57 35.24,18.57 | 35.24,18.57 37.47,18.57 Q1.A' | 35.24,18.57 35.24,21.59 | 35.24,21.59 35.24,23.5 IC5.29 | 35.24,21.59 37.78,21.59 R6.1
RST
  Bottom 0.254: AVR_ISP.5 63.66,54.45 63.66,47.47 66.67,47.47 69.85,44.29 R14.2
RXD  (via drill 0.35)
  Top 0.254: 33.89,19.29 27.94,13.34 FTDI.4 | 33.89,19.29 v34.29,19.68 | v61.12,18.89 60.8,19.21 33.97,19.21 33.89,19.29
  Bottom 0.254: 66.12,23.89 66.04,23.97 D7.A | 66.12,23.89 67.31,22.7 R25.1 66.99,23.18 D8.A | v34.29,19.68 34.29,23.5 IC5.30 | v61.12,18.89 66.12,23.89
SCK
  Bottom 0.254: AVR_ISP.3 60.96,45.56 62.23,44.29 R13.2
TXD  (via drill 0.35)
  Top 0.254: FTDI.5 25.4,16.03 31.11,21.75 32.86,21.75 v33.34,22.23 34.29,23.18 74.61,23.18 v80.17,28.73
  Bottom 0.254: R20.1 91.44,42.07 85.25,35.88 85.25,31.91 84.45,31.11 IC4.10 82.07,31.11 82.07,30.64 v80.17,28.73 | v33.34,22.23 33.5,22.38 33.5,23.5 IC5.31
VBAT  (via drill 0.35)
  Top 0.254: v33.02,47.31 35.72,44.61 v47.15,44.61 | JP5.5 88.11,4.29 67.79,4.29 S1.5
  Bottom 0.254: v33.02,47.31 31.75,48.58 D3.A | v47.15,44.61 50.64,41.12 50.64,17.94 S1.5
VBUS  (via drill 0.35)
  Top 0.254: v33.97,53.5 v37.15,53.5 | FTDI.3 v45.88,17.94
  Bottom 0.254: v37.15,53.5 40.72,49.93 | 40.72,49.93 41.91,48.74 D2.A | v33.97,53.5 34.13,53.66 34.13,54.93 X1.VBUS | FTDI.3 30.48,4.92 46.83,4.92 47.78,3.97 U$6.4 | 40.72,49.93 41.91,51.12 41.91,55.88 43.18,57.15 46.51,57.15 46.51,45.24 45.88,44.61 v45.88,17.94
VCC
  Bottom 0.254: AVR_ISP.2 58.42,55.88 61.44,55.88 62.23,55.09 62.23,48.1 66.04,44.29 R10.2